# EAGLE design espr-temp (EAGLE 8.3.1)
REV: 0.1
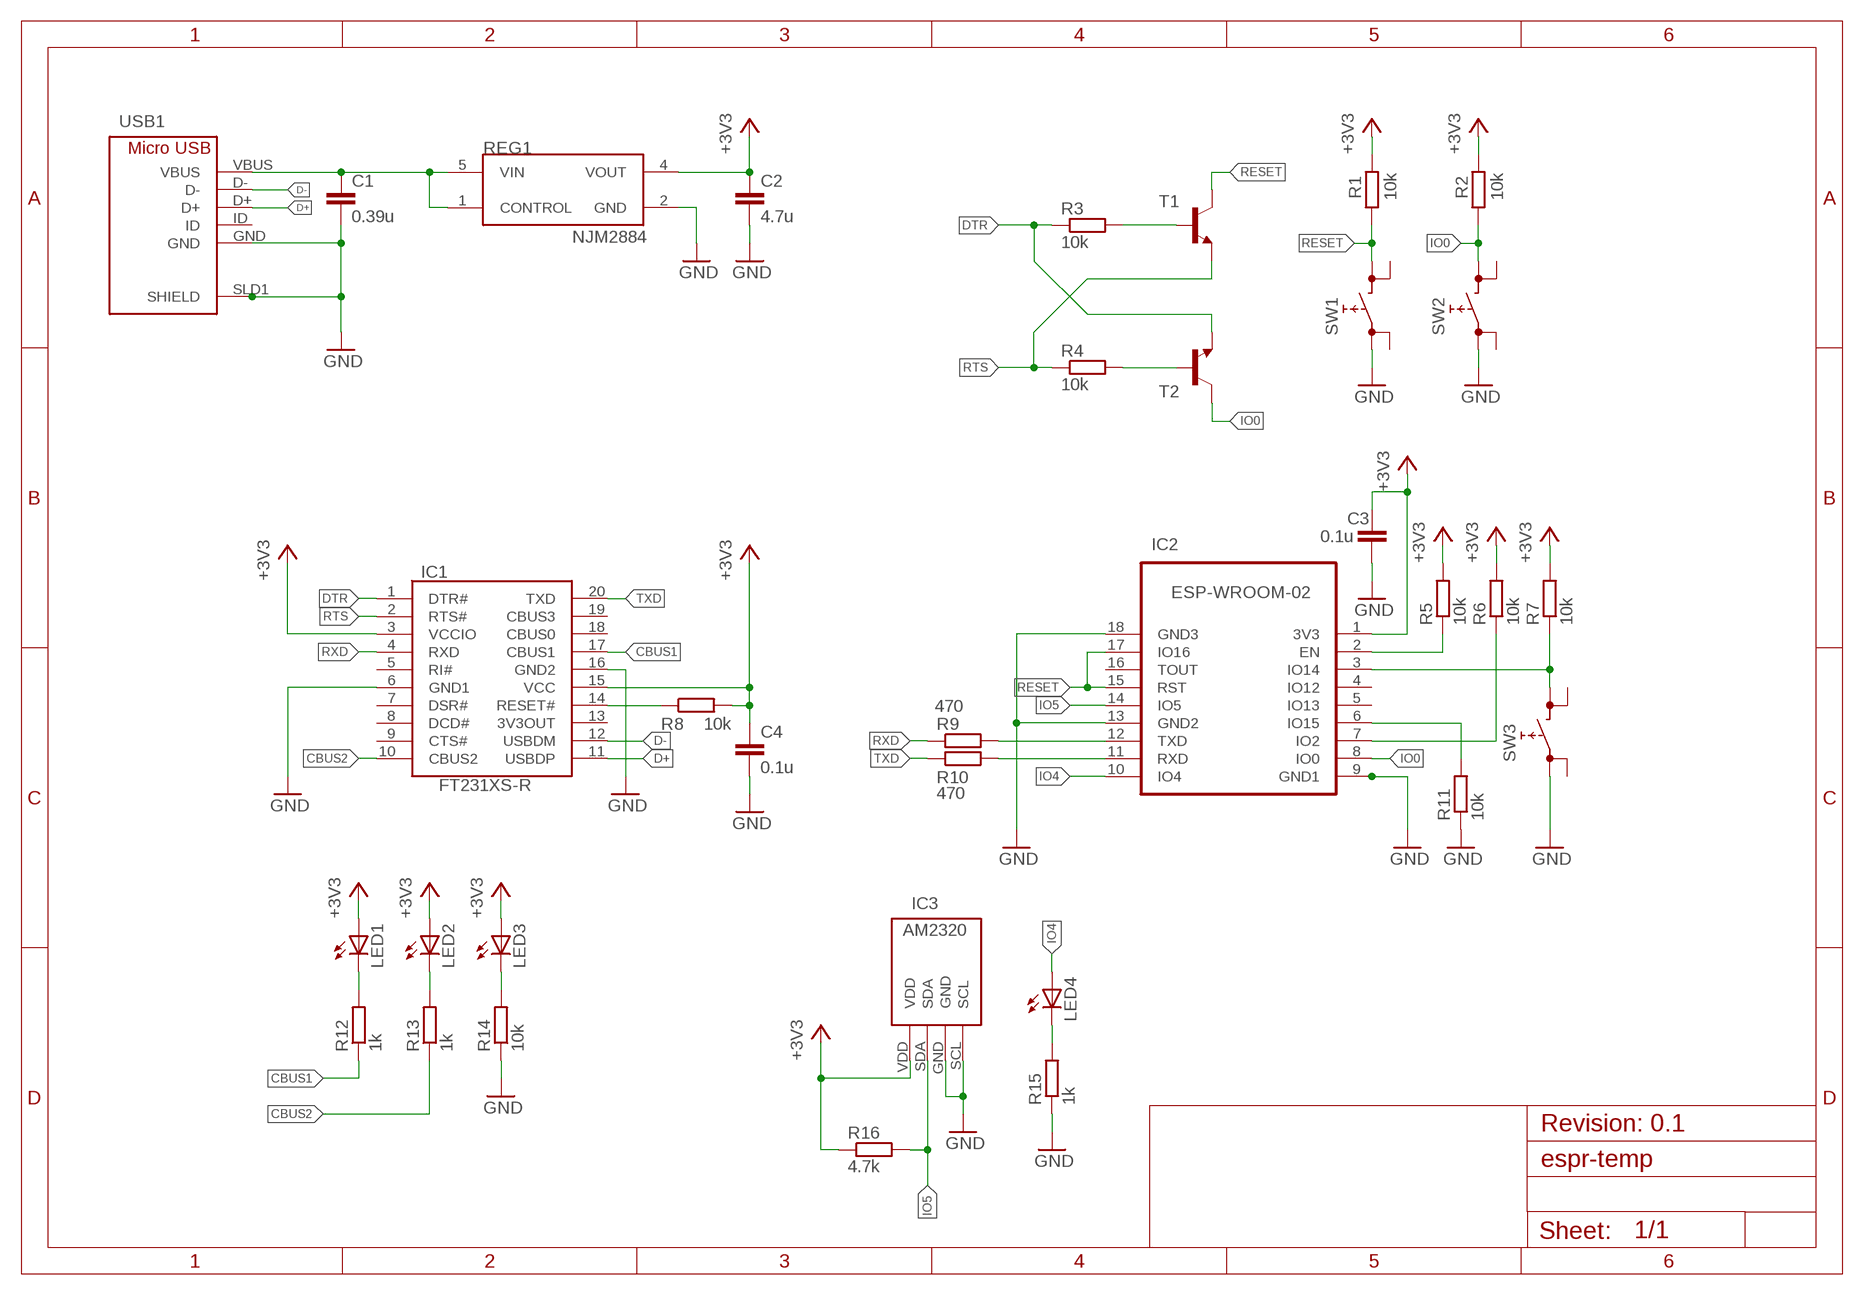
[diagram p0: schematic, sheet 1]

## Parts
C1  0.39u  C-EUC1608  [C1608]
C2  4.7u  C-EUC3216  [C3216]
C3  0.1u  C-EUC2012  [C2012]
C4  0.1u  C-EUC2012  [C2012]
IC1  FT231XS-R  [SOP64P599X175-20N]
IC2  ESP-WROOM-02  [ESP-WROOM-02]
IC3  AM2320  [AM2320]
LED1  OSHR1608  [C1608]
LED2  OSYG1608  [C1608]
LED3  OSYL1608  [C1608]
LED4  OSBL1608  [C1608]
R1  10k  R1608  [R1608]
R2  10k  R1608  [R1608]
R3  10k  R1608  [R1608]
R4  10k  R1608  [R1608]
R5  10k  R1608  [R1608]
R6  10k  R1608  [R1608]
R7  10k  R1608  [R1608]
R8  10k  R1608  [R1608]
R9  470  R1608  [R1608]
R10  470  R1608  [R1608]
R11  10k  R1608  [R1608]
R12  1k  R1608  [R1608]
R13  1k  R1608  [R1608]
R14  10k  R1608  [R1608]
R15  1k  R1608  [R1608]
R16  4.7k  R-EU_M0805  [M0805]
REG1  NJM2884  [NJM2884-SOT-89-5]
SW1  SKRPACE010  [SKRPACE010]
SW2  SKRPACE010  [SKRPACE010]
SW3  SKRPACE010  [SKRPACE010]
T1  2PD601A  [SOT346]
T2  2PD601A  [SOT346]
USB1  MICRO-USB  [ZX62B5PA]

## Nets
+3V3 [3V3]: C2.1 C3.1 C4.1 IC1.3(VCCIO) IC1.15(VCC) IC2.1(3V3) IC3.VDD LED1.A LED2.A LED3.A R1.2 R2.2 R5.2 R6.2 R7.2 R8.2 R16.1 REG1.4(VOUT)
CBUS1: IC1.17(CBUS1) R12.1
CBUS2: IC1.10(CBUS2) R13.1
D+: IC1.11(USBDP) USB1.D+
D-: IC1.12(USBDM) USB1.D-
DTR: IC1.1(DTR#) R3.1 T2.2(E)
GND [GND]: C1.2 C2.2 C3.2 C4.2 IC1.6(GND1) IC1.16(GND2) IC2.9(GND1) IC2.13(GND2) IC2.18(GND3) IC2.19(GND0) IC3.GND IC3.SCL R11.1 R14.1 R15.1 REG1.2(GND) SW1.1 SW2.1 SW3.1 USB1.GND USB1.SLD1(SHIELD) USB1.SLD2(SHIELD2) USB1.SLD3(SHIELD3) USB1.SLD4(SHIELD4) USB1.SLD5(SHIELD5) USB1.SLD6(SHIELD6)
IO0: IC2.8(IO0) R2.1 SW2.3 T2.3(C)
IO4: IC2.10(IO4) LED4.A
IO5: IC2.14(IO5) IC3.SDA R16.2
N$1: IC2.2(EN) R5.1
N$2: LED4.C R15.2
N$3: IC2.7(IO2) R6.1
N$4: C1.1 REG1.1(CONTROL) REG1.5(VIN) USB1.VBUS
N$5: LED1.C R12.2
N$6: R3.2 T1.1(B)
N$7: R4.2 T2.1(B)
N$8: LED2.C R13.2
N$9: LED3.C R14.2
N$10: IC2.12(TXD) R9.2
N$11: IC2.11(RXD) R10.2
N$12: IC2.6(IO15) R11.2
N$14: IC1.14(RESET#) R8.1
N$16: IC2.3(IO14) R7.1 SW3.3
RESET: IC2.15(RST) IC2.17(IO16) R1.1 SW1.3 T1.3(C)
RTS: IC1.2(RTS#) R4.1 T1.2(E)
RXD: IC1.4(RXD) R9.1
TXD: IC1.20(TXD) R10.1
Unconnected: IC1.5(RI#) IC1.7(DSR#) IC1.8(DCD#) IC1.9(CTS#) IC1.13(3V3OUT) IC1.18(CBUS0) IC1.19(CBUS3) IC2.4(IO12) IC2.5(IO13) IC2.16(TOUT) SW1.2 SW1.4 SW2.2 SW2.4 SW3.2 SW3.4 USB1.ID

## Notes on the sheet
- Revision: 0.1

## Library data of the parts
C1-C4 = rcl:C-EU: CAPACITOR, European symbol
IC1 = FT231XS-R:FT231XS-R: FTDI Chip FT231XS-R, Interface RS232, RS422, RS485, SIE, UART 3MBd, 5 V, 20-pin, SSOP Source: Datasheet <http://uk.rs-online.com/web/p/products/7570032P>; DESCRIPTION: FTDI Chip FT231XS-R, Interface RS232, RS422, RS485, SIE, UART 3MBd, 5 V, 20-pin, SSOP; HEIGHT: 1.7526mm; MANUFACTURER_NAME: FTDI Chip; MANUFACTURER_PART_NUMBER: FT231XS-R; RS_PART_NUMBER: 7570032P
IC2 = esp-wroom-02:ESP-WROOM-02: WiFi module - ESP-WROOM-02
IC3 = am2320:AM2320: AM2320 Digital Temperature and Humidity Sensor
LED1 = led-smd:OSHR1608
LED2 = led-smd:OSYG1608
LED3 = led-smd:OSYL1608
LED4 = led-smd:OSBL1608
R1-R15 = registors:R1608
R16 = rcl:R-EU_: RESISTOR, European symbol
REG1 = regulator:NJM2884
SW1-SW3 = switches:SKRPACE010
T1 T2 = transistors:2PD601A
USB1 = usb-connector:MICRO-USB

## Net classes
1 GND: width 0.406 mm, drill 0.102 mm, clearance 0.127 mm
2 3V3: width 0.406 mm, drill 0.102 mm, clearance 0.127 mm

## Board
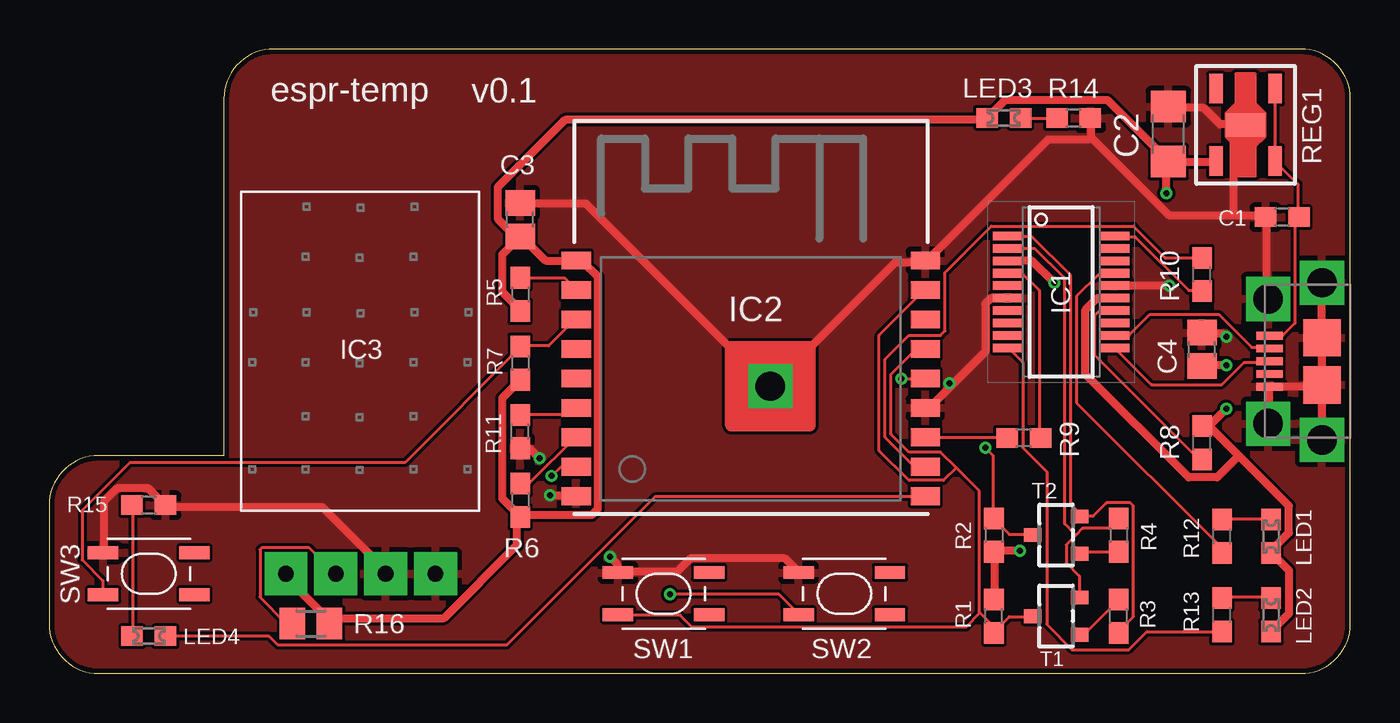
[diagram p1: board, top side]
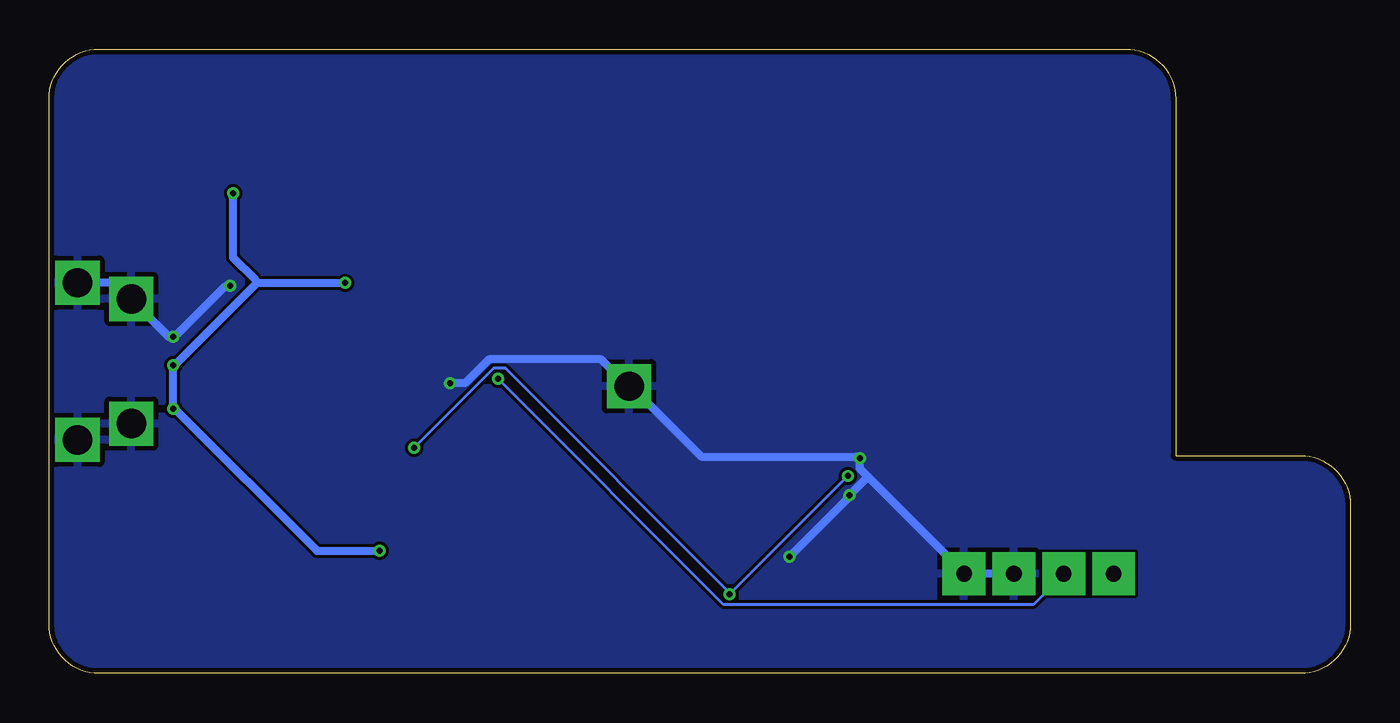
[diagram p2: board, bottom side, seen from below]

Size 66.3 x 31.8 mm. Coordinates in mm from the lower left corner, seen from the top.
Outline: 8.9,11.1 2.54,11.1 arc90 0,8.56 0,2.54 arc90 2.54,0 63.76,0 arc90 66.3,2.54 66.3,29.26 arc90 63.76,31.8 11.44,31.8 arc90 8.9,29.26 8.9,11.1
Copper layers (1*16): Top 0.035mm / dielectric 1.5mm / Bottom 0.035mm
Design rules "SeeedStudio_2layer_DRU_no_angle_20140221": minimum track width 6mil, minimum drill 12mil, track to track 6mil, track to pad 6mil, pad to pad 6mil, via to via 6mil, smd to smd 0mil, copper to edge 10mil, drill to drill 10mil, minimum pad ring 10mil, minimum via ring 6mil, stop-mask expansion 2mil, vias tented up to drill 100mil, thermal gap 10mil

### Footprints (pad centres in the part's own frame; a part is rotated, then mirrored left to right if it is on the bottom)
C1608 = smd 1.1 x 1: 1 -0.85,0; 2 0.85,0
C3216 = smd 1.6 x 1.8: 1 -1.4,0; 2 1.4,0
C2012 = smd 1.3 x 1.5: 1 -0.85,0; 2 0.85,0
SOP64P599X175-20N = smd 1.526 x 0.435: 1 -2.712,2.858; 2 -2.712,2.222; 3 -2.712,1.588; 4 -2.712,0.952; 5 -2.712,0.318; 6 -2.712,-0.318; 7 -2.712,-0.952; 8 -2.712,-1.588; 9 -2.712,-2.222; 10 -2.712,-2.858; 11 2.712,-2.858; 12 2.712,-2.222; 13 2.712,-1.588; 14 2.712,-0.952; 15 2.712,-0.318; 16 2.712,0.318; 17 2.712,0.952; 18 2.712,1.588; 19 2.712,2.222; 20 2.712,2.858
ESP-WROOM-02 = smd 1.485 x 0.9: 1 -8.893,4.9; 2 -8.893,3.4; 3 -8.893,1.9; 4 -8.893,0.4; 5 -8.893,-1.1; 6 -8.893,-2.6; 7 -8.893,-4.1; 8 -8.893,-5.6; 9 -8.893,-7.1; 10 8.893,-7.1; 11 8.893,-5.6; 12 8.893,-4.1; 13 8.893,-2.6; 14 8.893,-1.1; 15 8.893,0.4; 16 8.893,1.9; 17 8.893,3.4; 18 8.893,4.9 | drill 1.5 pad 2 square: 19 1,-1.5
AM2320 = drill 0.8 pad 2.184 square: GND 1.27,-11.43; SCL 3.81,-11.43; SDA -1.27,-11.43; VDD -3.81,-11.43
C1608' = smd 1.1 x 1: A 0.85,0; C -0.85,0
R1608 = smd 1.1 x 1: 1 -0.85,0; 2 0.85,0
M0805 = smd 1.3 x 1.6: 1 -0.95,0; 2 0.95,0
NJM2884-SOT-89-5 = smd 0.7 x 1.5: 1 -1.5,-1.85; 3 1.5,-1.85; 4 1.5,1.85; 5 -1.5,1.85 | smd 2 x 1.2: 2 0,0
SKRPACE010 = smd 1.55 x 0.65: 1 -2.325,1.075; 2 2.325,1.075; 3 -2.325,-1.075; 4 2.325,-1.075
SOT346 = smd 0.7 x 0.9: 1 -0.95,-1.2; 2 0.95,-1.2; 3 0,1.2
ZX62B5PA = smd 0.4 x 1.35: D+ 0,4.125; D- 0.65,4.125; GND -1.3,4.125; ID -0.65,4.125; VBUS 1.3,4.125 | drill 1.499 pad 2.032 square: SLD1 -3.175,4.191; SLD2 3.175,4.191; SLD3 -4,1.45; SLD6 4,1.45 | smd 1.9 x 1.9: SLD4 -1.2,1.45; SLD5 1.2,1.45

### Placement (x,y rotation side)
C1  62.83,23.24 180 top
C2  57.02,27.47 90 top
C3  24,23.11 90 top
C4  58.74,16.51 90 top
IC1  51.56,19.43 0 top
IC2  35.75,16.13 0 top
IC3  15.88,16.51 0 top
LED1  [C1608']  62.26,6.99 270 top
LED2  [C1608']  62.26,2.98 270 top
LED3  [C1608']  48.64,28.3 180 top
LED4  [C1608']  5.08,1.91 0 top
R1  48.13,2.92 90 top
R2  48.13,7.05 270 top
R3  54.48,2.92 90 top
R4  54.48,7.05 270 top
R5  24,19.3 270 top
R6  24,8.83 270 top
R7  24,15.81 270 top
R8  58.74,11.75 90 top
R9  49.66,12 180 top
R10  58.74,20.32 90 top
R11  24,12.32 90 top
R12  59.75,6.99 90 top
R13  59.75,2.98 90 top
R14  52.2,28.28 180 top
R15  5.08,8.57 180 top
R16  13.34,2.54 180 top
REG1  60.96,27.94 180 top
SW1  31.31,4.06 0 top
SW2  40.51,4.06 0 top
SW3  5.08,5.08 0 top
T1  51.31,2.92 90 top
T2  51.31,7.05 90 top
USB1  66.3,15.9 90 top

### Tracks (layer width: path | path; a pad name or v marks a point on that pad's centre or on a via)
+3V3  (via drill 0.3)
  Top 0.406: R5.2 24,18.52 23.09,19.43 23.09,21.34 C3.1 | C3.1 24.16,22.17 25.3,21.03 26.82,21.03 IC2.1 27.05,20.95 27.2,20.95 27.96,20.19 27.96,8.38 27.66,8.08 24.16,8.08 R6.2 | R6.2 24,8 23.09,8.91 23.09,14.02 24,14.94 R7.2 | IC3.VDD 12.12,5.03 12.12,4.88 14.25,2.74 14.25,2.59 R16.1 14.4,2.82 20.12,2.82 23.85,6.55 23.85,7.85 R6.2 | C2.1 57,26.14 53.95,29.18 48.69,29.18 47.85,28.35 LED3.A 47.62,28.19 26.29,28.19 22.86,24.77 22.86,23.16 23.77,22.25 C3.1 | REG1.4 59.44,26.06 57.23,26.06 C2.1 | R1.2 48.16,3.81 48.16,6.17 R2.2 48.31,6.25 v49.45,6.25 | LED2.A 62.33,2.21 63.17,3.05 63.17,5.26 62.33,6.1 LED1.A 62.33,6.33 63.17,7.16 63.17,8.53 60.62,11.09 | 60.62,11.09 59.13,12.57 58.75,12.57 R8.2 59.21,12.72 v59.97,13.49 | v59.97,15.7 58.75,15.7 C4.1 | v51.21,19.89 50.06,21.03 48.92,21.03 IC1.3 | 60.62,11.09 59.51,9.98 58.06,9.98 52.81,15.24 52.81,18.52 53.42,19.13 54.25,19.13 IC1.15 | v56.92,24.46 56.92,25.91 C2.1
  Bottom 0.406: 55.7,19.89 v51.21,19.89 | 55.7,19.89 59.82,15.77 v59.97,15.7 v59.97,13.49 59.82,13.41 52.65,6.25 v49.45,6.25 | v56.92,24.46 56.92,21.18 55.78,20.04 55.7,19.89
CBUS1
  Top 0.152: R12.1 59.74,6.17 59.74,6.4 52.35,13.79 52.35,19.2 53.49,20.34 54.25,20.34 IC1.17
CBUS2
  Top 0.152: R13.1 55.93,2.13 55.02,1.22 52.12,1.22 50.83,2.52 50.83,10.29 49.61,11.51 49.61,15.85 48.92,16.54 IC1.10
D+
  Top 0.152: USB1.D+ 62.1,15.85 60.88,15.85 59.74,14.71 56.16,14.71 54.33,16.54 IC1.11
D-
  Top 0.152: USB1.D- 62.1,16.61 61.27,16.61 59.59,18.29 56.08,18.29 55.02,17.22 54.33,17.22 IC1.12
DTR
  Top 0.152: R3.1 54.48,2.13 55.24,2.9 55.24,8.53 55.09,8.69 53.87,8.69 53.19,8 52.58,8 T2.2 52.58,8.08 52.05,8.61 52.05,20.27 50.06,22.25 48.92,22.25 IC1.1
GND  (via drill 0.3)
  Top 0.406: SW3.1 2.82,6.17 2.82,8.76 3.5,9.45 5.03,9.45 5.87,8.61 R15.1 6.1,8.46 13.95,8.46 17.14,5.26 IC3.GND | SW2.1 38.18,5.18 37.49,5.87 32.69,5.87 32,5.18 29.03,5.18 SW1.1 28.96,5.33 28.96,5.56 v28.57,5.94 | v24.99,10.97 24.54,11.43 24,11.43 R11.1 | v25.53,9.07 26.82,9.07 IC2.9 | USB1.SLD4 64.85,17.07 USB1.SLD5 64.85,17.3 64.85,19.89 USB1.SLD6 | USB1.SLD1 62.18,12.72 62.18,14.55 USB1.GND 62.33,14.63 64.69,14.63 USB1.SLD4 | USB1.SLD3 64.85,11.96 64.85,14.48 USB1.SLD4 | C2.2 57.07,28.8 58.83,28.8 59.66,27.96 60.96,27.96 REG1.2 60.35,27.81 60.35,23.32 | USB1.SLD2 62.1,19.13 62.03,19.2 62.03,23.24 C1.2 61.8,23.32 60.35,23.32 | 53.11,27.28 53.11,28.27 R14.1 | 53.11,27.28 57.07,23.32 60.35,23.32 | v59.97,17.14 59.82,17.3 58.75,17.3 C4.2 | v57.07,19.74 54.33,19.74 IC1.16 | 45.99,14.67 47.7,16.38 47.7,18.82 48.01,19.13 48.84,19.13 IC1.6 | 45.99,14.67 44.88,13.56 44.65,13.56 IC2.13 | C3.2 24,23.93 27.36,23.93 36.58,14.71 IC2.19 36.8,14.63 43.13,20.95 44.58,20.95 IC2.18 44.81,21.11 50.9,27.2 52.96,27.2 53.11,27.28 | v45.87,14.78 45.99,14.67
  Bottom 0.406: 24.57,10.02 19.66,5.11 IC3.SCL 19.51,5.11 17.14,5.11 IC3.GND | 24.57,10.02 24.99,10.44 v24.99,10.97 25.15,11.05 33.07,11.05 36.58,14.55 IC2.19 36.8,14.63 38.18,16 43.89,16 45.11,14.78 v45.87,14.78 | 24.57,10.02 v25.53,9.07 25.6,8.91 v28.57,5.94 | v57.07,19.74 57.3,19.74 59.82,17.22 v59.97,17.14 60.2,17.14 62.1,19.05 USB1.SLD2 62.26,19.2 62.94,19.89 64.85,19.89 USB1.SLD6
  pour Top: 67.94,33.02 67.94,-1.27 -1.27,-1.27 -1.27,-0.64 -1.27,33.02
  pour Bottom: 67.31,33.02 67.31,-1.27 -0.64,-1.27 -0.64,-0.64 -0.64,33.02
IO0  (via drill 0.3)
  Top 0.152: T2.3 50.06,7.09 48.92,7.09 48.16,7.85 R2.1 48.08,7.92 48.08,11.12 v47.7,11.51 | v25.6,10.06 26.06,10.52 26.82,10.52 IC2.8 | v31.62,4.04 37.19,4.04 38.18,3.05 SW2.3
  Bottom 0.152: v25.6,10.06 v31.62,4.04 31.62,4.12 43.05,15.54 43.66,15.54 v47.7,11.51
IO4
  Top 0.152: LED4.A 11.2,1.91 11.66,1.45 23.32,1.45 30.86,8.99 44.58,8.99 IC2.10
IO5  (via drill 0.3)
  Top 0.152: v43.43,15.01 44.58,15.01 IC2.14 | R16.2 12.34,2.59 12.04,2.59 10.74,3.89 10.74,6.33 10.82,6.4 13.26,6.4 14.55,5.11 IC3.SDA
  Bottom 0.152: v43.43,15.01 31.93,3.5 16.15,3.5 14.63,5.03 IC3.SDA
N$1
  Top 0.152: R5.1 24,20.12 26.29,20.12 26.82,19.58 IC2.2
N$2
  Top 0.152: LED4.C 4.27,1.91 4.27,8.53 R15.2
N$3
  Top 0.152: R6.1 24.46,9.68 26.82,12.04 IC2.7 | R6.1
N$4
  Top 0.152: 63.63,23.24 63.63,24.92 62.48,26.06 REG1.5 62.48,26.14 62.48,29.72 REG1.1 | 63.63,23.24 63.48,23.09 63.48,17.83 62.87,17.22 62.18,17.22 USB1.VBUS | 63.63,23.24 C1.1
N$5
  Top 0.152: R12.2 59.82,7.85 62.26,7.85 LED1.C
N$6
  Top 0.152: T1.1 52.58,1.98 52.73,1.98 54.48,3.73 R3.2
N$7
  Top 0.152: T2.1 52.58,6.17 54.48,6.17 R4.2
N$8
  Top 0.152: R13.2 59.82,3.89 62.26,3.89 LED2.C
N$9
  Top 0.152: R14.2 51.28,28.27 49.53,28.27 LED3.C
N$10
  Top 0.152: R9.2 48.77,12.04 44.65,12.04 IC2.12
N$11
  Top 0.152: R10.2 58.67,21.18 56.84,21.18 55.24,22.78 48.01,22.78 45.64,20.42 45.64,17.45 45.41,17.22 43.81,17.22 42.6,16 42.6,12.04 44.04,10.59 44.58,10.59 IC2.11
N$12
  Top 0.152: R11.2 24,13.18 26.52,13.18 26.82,13.49 IC2.6
N$14
  Top 0.152: R8.1 58.67,10.97 58.52,10.97 53.26,16.23 53.26,18.21 53.49,18.44 54.25,18.44 IC1.14
N$16
  Top 0.152: IC2.3 26.82,18.06 25.45,16.69 24,16.69 R7.1 24,16.61 18.14,10.74 4.12,10.74 1.68,8.31 1.68,5.79 2.74,4.72 2.74,4.04 SW3.3
RESET
  Top 0.152: T1.3 50.06,2.9 48.92,2.9 48.16,2.13 R1.1 48.23,2.29 47.43,3.09 | 46.22,10.48 47.4,9.3 47.4,3.12 47.43,3.09 | 46.22,10.48 45.41,11.28 43.81,11.28 42.9,12.19 42.9,15.24 44.12,16.46 44.58,16.46 IC2.15 | 46.22,10.48 45.57,9.83 43.81,9.83 42.29,11.35 42.29,17.22 44.58,19.51 IC2.17 | 47.43,3.09 46.71,2.36 32.77,2.36 32.16,2.97 29.03,2.97 SW1.3
RTS
  Top 0.152: 52.31,7.05 52.65,7.39 54.03,7.39 54.48,7.85 R4.1 | 52.31,7.05 51.82,6.55 51.82,5.64 52.5,4.95 52.5,3.89 T1.2 | 52.31,7.05 51.74,7.62 51.74,20.12 50.22,21.64 48.92,21.64 IC1.2
RXD
  Top 0.152: R9.1 50.44,12.04 50.44,19.51 49.61,20.34 48.92,20.34 IC1.4
TXD
  Top 0.152: R10.1 58.67,19.51 58.06,19.51 55.32,22.25 54.33,22.25 IC1.20

### Text on the board
tPlace: espr-temp | v0.1